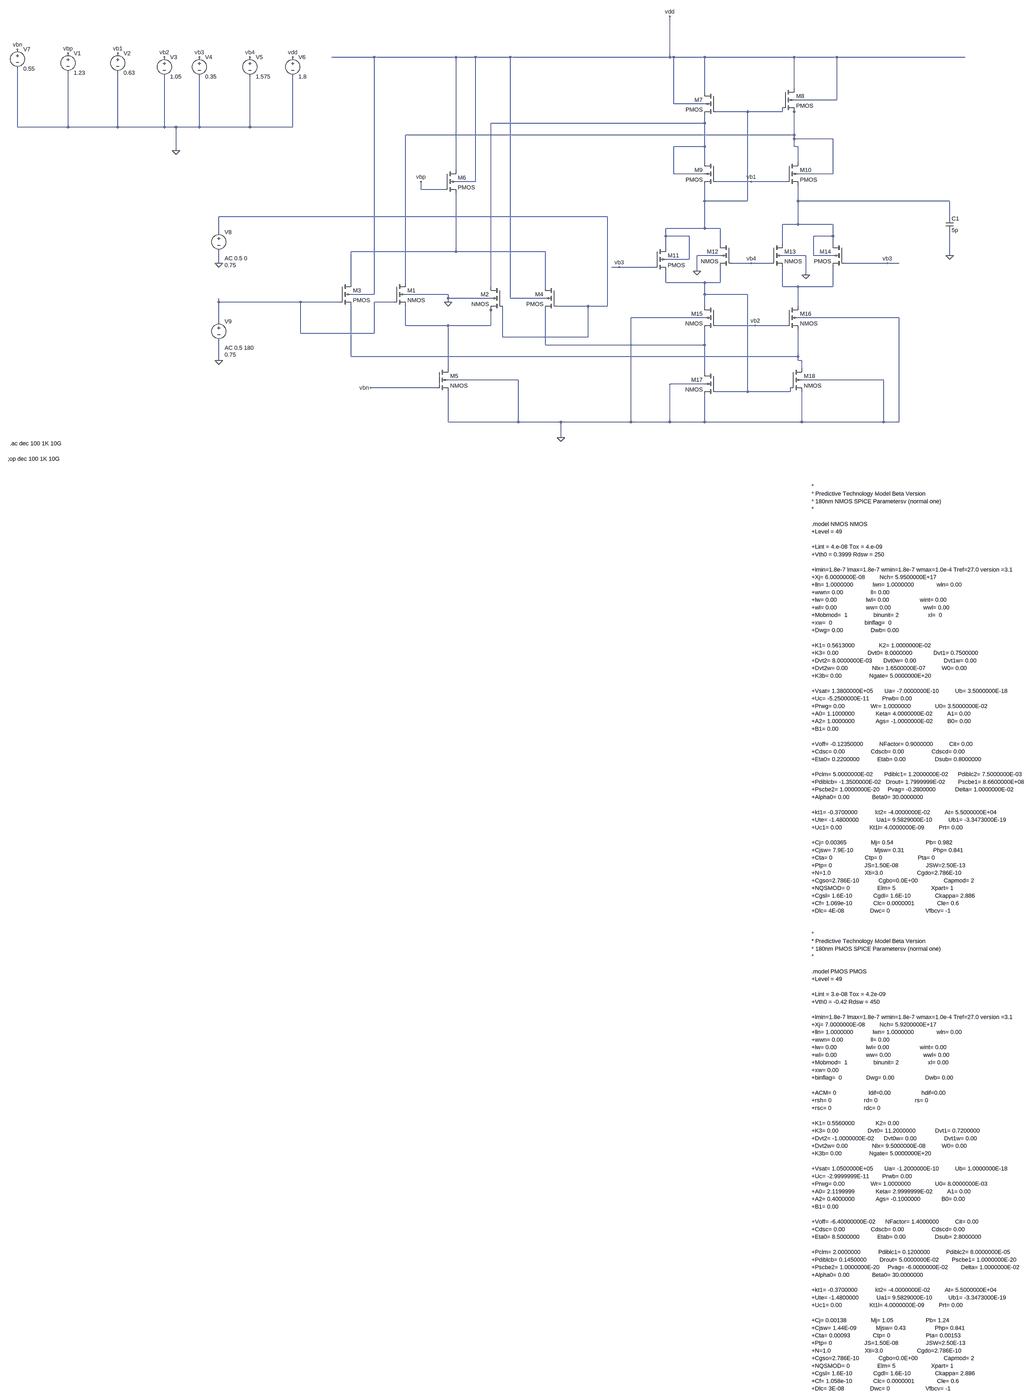
[diagram p0: schematic rail_to_rail_stage1.1_68db.asc, whole sheet]
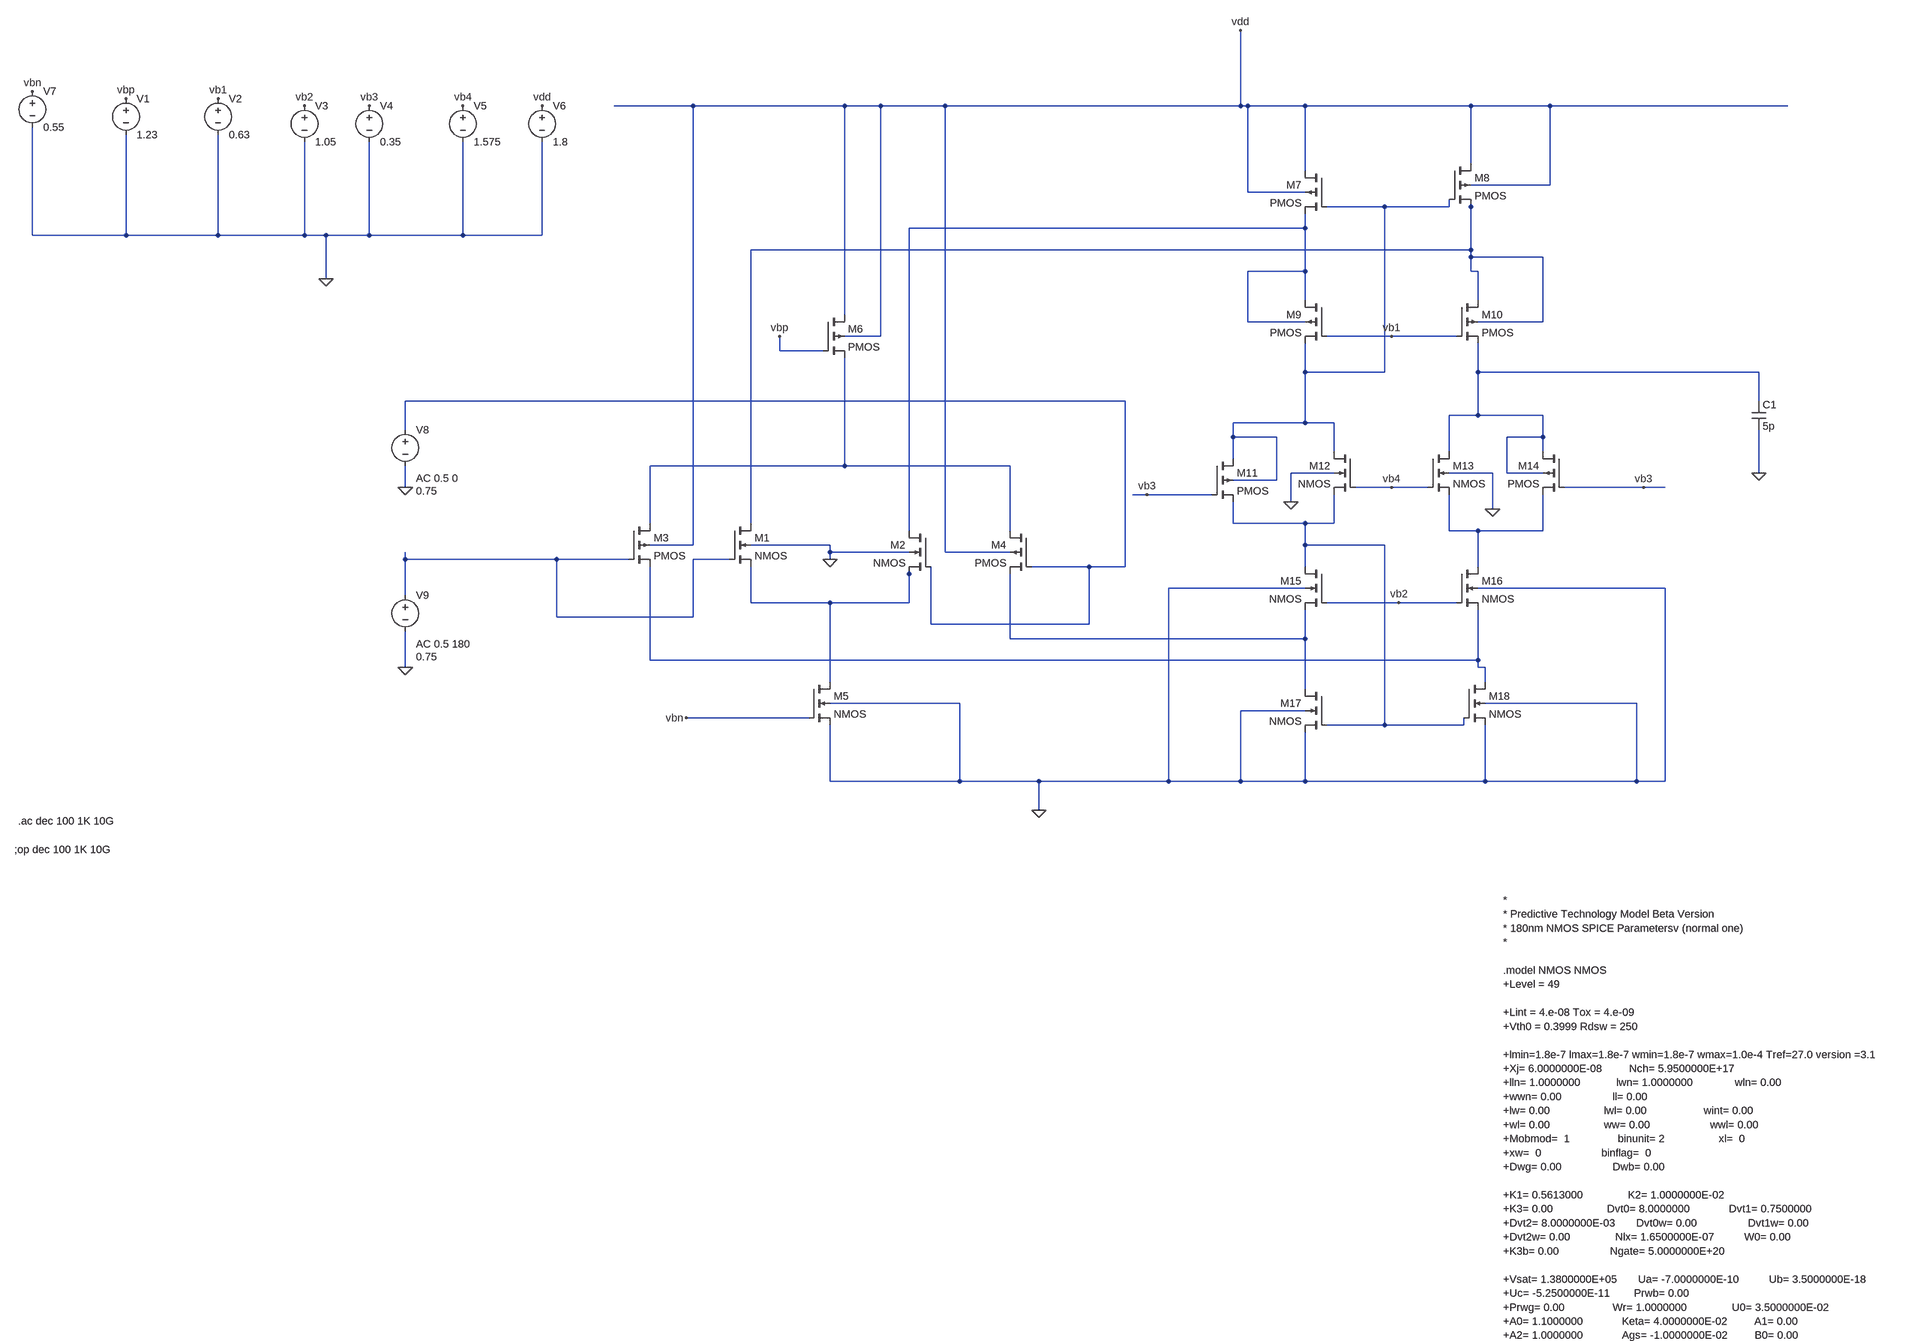
[diagram p1: schematic rail_to_rail_stage1.1_68db.asc, part, row 1 of 2, column 1 of 1]
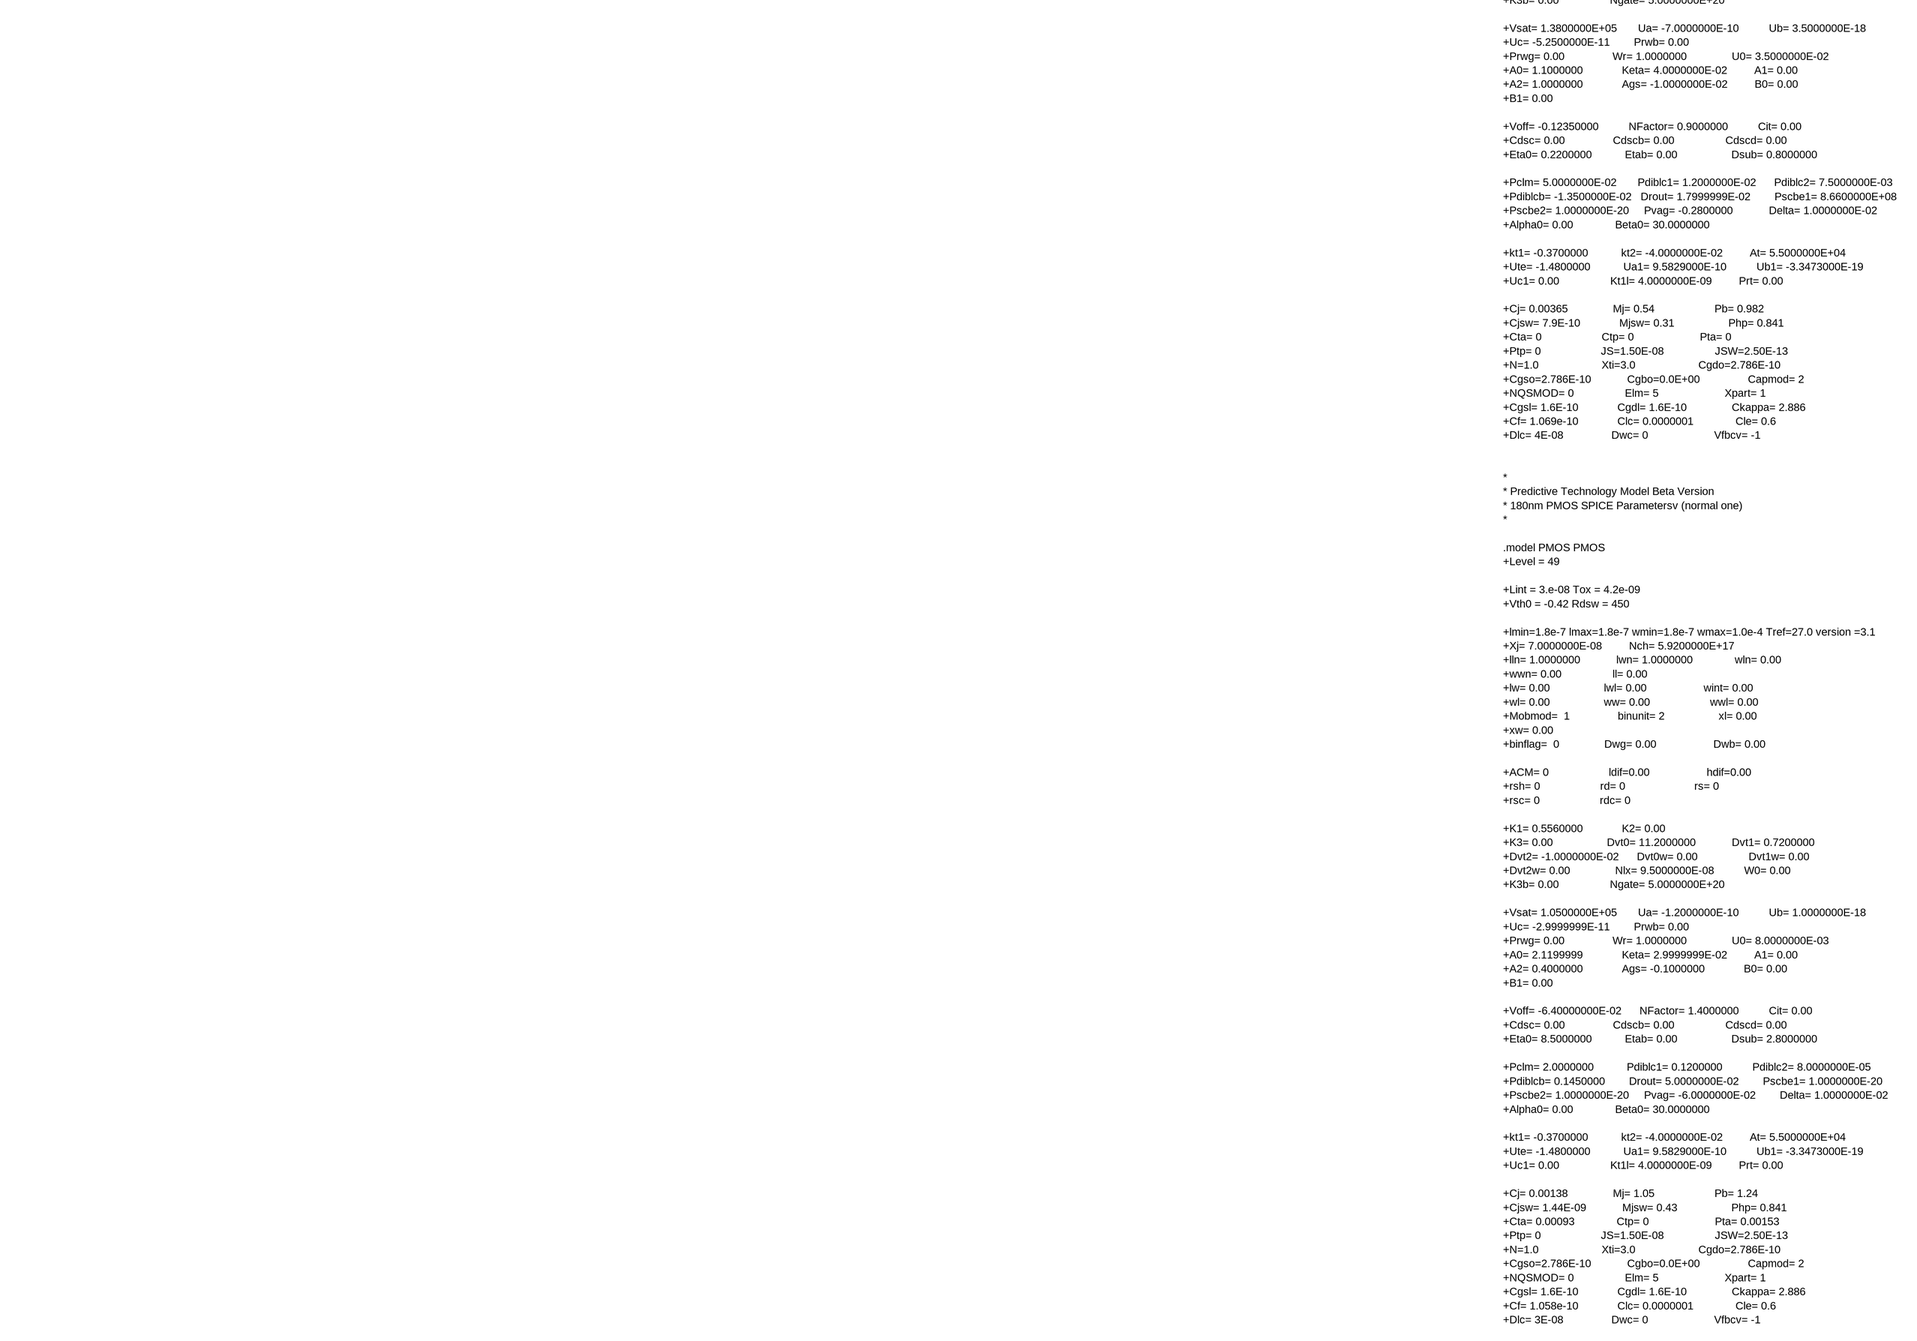
[diagram p2: schematic rail_to_rail_stage1.1_68db.asc, part, row 2 of 2, column 1 of 1]
rail_to_rail_stage1.1_68db.asc, the LTspice schematic file:
Version 4
SHEET 1 2760 4552
WIRE -144 -704 -320 -704
WIRE 192 -704 -144 -704
WIRE 272 -704 192 -704
WIRE 416 -704 272 -704
WIRE 1072 -704 1072 -912
WIRE 1072 -704 416 -704
WIRE 1088 -704 1072 -704
WIRE 1216 -704 1088 -704
WIRE 1584 -704 1216 -704
WIRE 1760 -704 1584 -704
WIRE 2288 -704 1760 -704
WIRE 1584 -576 1584 -704
WIRE 1216 -560 1216 -704
WIRE 1760 -528 1760 -704
WIRE 1760 -528 1584 -528
WIRE 1088 -512 1088 -704
WIRE 1216 -512 1088 -512
WIRE 1392 -480 1264 -480
WIRE 1536 -480 1536 -496
WIRE 1536 -480 1392 -480
WIRE 1584 -480 1584 -496
WIRE 1216 -432 1216 -464
WIRE 1216 -432 336 -432
WIRE -1696 -416 -1696 -656
WIRE -1488 -416 -1488 -640
WIRE -1488 -416 -1696 -416
WIRE -1280 -416 -1280 -640
WIRE -1280 -416 -1488 -416
WIRE -1088 -416 -1088 -624
WIRE -1088 -416 -1280 -416
WIRE -1040 -416 -1088 -416
WIRE -944 -416 -944 -624
WIRE -944 -416 -1040 -416
WIRE -736 -416 -736 -624
WIRE -736 -416 -944 -416
WIRE -560 -416 -560 -624
WIRE -560 -416 -736 -416
WIRE 1584 -384 1584 -480
WIRE 1584 -384 -16 -384
WIRE 1584 -368 1584 -384
WIRE 1744 -368 1584 -368
WIRE 1216 -336 1216 -432
WIRE 1216 -336 1088 -336
WIRE 1584 -336 1584 -368
WIRE 1600 -336 1584 -336
WIRE -1040 -320 -1040 -416
WIRE 1216 -272 1216 -336
WIRE 1600 -272 1600 -336
WIRE 192 -240 192 -704
WIRE 1088 -224 1088 -336
WIRE 1216 -224 1088 -224
WIRE 1744 -224 1744 -368
WIRE 1744 -224 1600 -224
WIRE 272 -192 272 -704
WIRE 272 -192 192 -192
WIRE 1408 -192 1264 -192
WIRE 1552 -192 1408 -192
WIRE 48 -160 48 -192
WIRE 144 -160 48 -160
WIRE 1216 -112 1216 -176
WIRE 1392 -112 1392 -480
WIRE 1392 -112 1216 -112
WIRE 1600 -112 1600 -176
WIRE 2224 -112 1600 -112
WIRE 816 -48 -864 -48
WIRE 2224 -48 2224 -112
WIRE 1600 -16 1600 -112
WIRE 1600 -16 1536 -16
WIRE 1744 -16 1600 -16
WIRE 1216 0 1216 -112
WIRE 1216 0 1056 0
WIRE 1280 0 1216 0
WIRE -864 16 -864 -48
WIRE 1056 32 1056 0
WIRE 1152 32 1056 32
WIRE 1744 32 1744 -16
WIRE 1744 32 1664 32
WIRE 1280 64 1280 0
WIRE 1536 64 1536 -16
WIRE 1744 64 1744 32
WIRE 1056 80 1056 32
WIRE 192 96 192 -144
WIRE 192 96 -240 96
WIRE 560 96 192 96
WIRE 1280 112 1184 112
WIRE 1632 112 1536 112
WIRE 1664 112 1664 32
WIRE 1744 112 1664 112
WIRE 2224 112 2224 16
WIRE 1152 128 1152 32
WIRE 1152 128 1056 128
WIRE -864 144 -864 96
WIRE 1408 144 1328 144
WIRE 1488 144 1408 144
WIRE 1968 144 1792 144
WIRE 2016 144 1968 144
WIRE 864 160 832 160
WIRE 1008 160 864 160
WIRE 1184 176 1184 112
WIRE 1632 192 1632 112
WIRE -240 224 -240 96
WIRE -16 224 -16 -384
WIRE 1056 224 1056 176
WIRE 1216 224 1056 224
WIRE 1280 224 1280 160
WIRE 1280 224 1216 224
WIRE 336 240 336 -432
WIRE 560 240 560 96
WIRE 1536 240 1536 160
WIRE 1600 240 1536 240
WIRE 1744 240 1744 160
WIRE 1744 240 1600 240
WIRE -144 272 -144 -704
WIRE -144 272 -240 272
WIRE 160 272 -16 272
WIRE 1216 272 1216 224
WIRE 1392 272 1216 272
WIRE 160 288 160 272
WIRE 336 288 160 288
WIRE 416 288 416 -704
WIRE 560 288 416 288
WIRE -864 304 -864 288
WIRE -528 304 -864 304
WIRE -288 304 -528 304
WIRE -64 304 -144 304
WIRE 160 304 160 288
WIRE 736 320 608 320
WIRE 816 320 816 -48
WIRE 816 320 736 320
WIRE 1216 320 1216 272
WIRE 1600 320 1600 240
WIRE 336 336 336 320
WIRE 1216 368 912 368
WIRE 2016 368 1600 368
WIRE -864 384 -864 304
WIRE -16 400 -16 320
WIRE 160 400 -16 400
WIRE 336 400 336 336
WIRE 336 400 160 400
WIRE 1424 400 1264 400
WIRE 1552 400 1424 400
WIRE -528 432 -528 304
WIRE -144 432 -144 304
WIRE -144 432 -528 432
WIRE 384 448 384 320
WIRE 736 448 736 320
WIRE 736 448 384 448
WIRE 560 480 560 336
WIRE 1216 480 1216 416
WIRE 1216 480 560 480
WIRE -240 528 -240 320
WIRE 1600 528 1600 416
WIRE 1600 528 -240 528
WIRE -864 544 -864 464
WIRE 1600 544 1600 528
WIRE 1616 544 1600 544
WIRE 160 576 160 400
WIRE 1616 576 1616 544
WIRE 1216 592 1216 480
WIRE 448 624 160 624
WIRE 1952 624 1616 624
WIRE 1216 640 1072 640
WIRE 112 656 -160 656
WIRE 1392 672 1392 272
WIRE 1392 672 1264 672
WIRE 1568 672 1568 656
WIRE 1568 672 1392 672
WIRE 160 912 160 672
WIRE 448 912 448 624
WIRE 448 912 160 912
WIRE 624 912 448 912
WIRE 912 912 912 368
WIRE 912 912 624 912
WIRE 1072 912 1072 640
WIRE 1072 912 912 912
WIRE 1216 912 1216 688
WIRE 1216 912 1072 912
WIRE 1616 912 1616 672
WIRE 1616 912 1216 912
WIRE 1952 912 1952 624
WIRE 1952 912 1616 912
WIRE 2016 912 2016 368
WIRE 2016 912 1952 912
WIRE 624 976 624 912
FLAG 160 304 0
FLAG 624 976 0
FLAG 1184 176 0
FLAG 1632 192 0
FLAG -1040 -320 0
FLAG -1280 -720 vb1
FLAG -1088 -704 vb2
FLAG -944 -704 vb3
FLAG -736 -704 vb4
FLAG -560 -704 vdd
FLAG 1424 400 vb2
FLAG 1408 144 vb4
FLAG 1408 -192 vb1
FLAG 1968 144 vb3
FLAG 864 160 vb3
FLAG 1072 -912 vdd
FLAG 48 -192 vbp
FLAG -160 656 vbn
FLAG -1696 -736 vbn
FLAG -1488 -720 vbp
FLAG -864 144 0
FLAG -864 544 0
FLAG 2224 112 0
SYMBOL nmos4 -64 224 R0
SYMATTR InstName M1
SYMATTR Value2 l=1u w=56u
SYMBOL nmos4 384 240 M0
SYMATTR InstName M2
SYMATTR Value2 l=1u w=56u
SYMBOL nmos4 112 576 R0
SYMATTR InstName M5
SYMATTR Value2 l=1u w=20u
SYMBOL nmos4 1568 576 R0
SYMATTR InstName M18
SYMATTR Value2 l=1u w=3u
SYMBOL nmos4 1552 320 R0
SYMATTR InstName M16
SYMATTR Value2 l=1u w=1.2u
SYMBOL nmos4 1264 320 M0
SYMATTR InstName M15
SYMATTR Value2 l=1u w=1.2u
SYMBOL nmos4 1264 592 M0
SYMATTR InstName M17
SYMATTR Value2 l=1u w=3u
SYMBOL nmos4 1328 64 M0
SYMATTR InstName M12
SYMATTR Value2 l=1u w=0.76u
SYMBOL nmos4 1488 64 R0
SYMATTR InstName M13
SYMATTR Value2 l=1u w=0.76u
SYMBOL pmos4 -288 224 R0
SYMATTR InstName M3
SYMATTR Value2 l=1u w=364u
SYMBOL pmos4 608 240 M0
SYMATTR InstName M4
SYMATTR Value2 l=1u w=364u
SYMBOL pmos4 144 -240 R0
SYMATTR InstName M6
SYMATTR Value2 l=1u w=110u
SYMBOL pmos4 1008 80 R0
SYMATTR InstName M11
SYMATTR Value2 l=1u w=3.2u
SYMBOL pmos4 1552 -272 R0
SYMATTR InstName M10
SYMATTR Value2 l=1u w=8u
SYMBOL pmos4 1536 -576 R0
SYMATTR InstName M8
SYMATTR Value2 l=1u w=13u
SYMBOL pmos4 1264 -560 M0
SYMATTR InstName M7
SYMATTR Value2 l=1u w=13u
SYMBOL pmos4 1264 -272 M0
SYMATTR InstName M9
SYMATTR Value2 l=1u w=8u
SYMBOL pmos4 1792 64 M0
SYMATTR InstName M14
SYMATTR Value2 l=1u w=3.2u
SYMBOL voltage -1280 -736 R0
WINDOW 123 0 0 Left 0
WINDOW 39 0 0 Left 0
SYMATTR InstName V2
SYMATTR Value 0.63
SYMBOL voltage -1088 -720 R0
WINDOW 123 0 0 Left 0
WINDOW 39 0 0 Left 0
SYMATTR InstName V3
SYMATTR Value 1.05
SYMBOL voltage -944 -720 R0
WINDOW 123 0 0 Left 0
WINDOW 39 0 0 Left 0
SYMATTR InstName V4
SYMATTR Value 0.35
SYMBOL voltage -736 -720 R0
WINDOW 123 0 0 Left 0
WINDOW 39 0 0 Left 0
SYMATTR InstName V5
SYMATTR Value 1.575
SYMBOL voltage -560 -720 R0
WINDOW 123 0 0 Left 0
WINDOW 39 0 0 Left 0
SYMATTR InstName V6
SYMATTR Value 1.8
SYMBOL voltage -1488 -736 R0
WINDOW 123 0 0 Left 0
WINDOW 39 0 0 Left 0
SYMATTR InstName V1
SYMATTR Value 1.23
SYMBOL voltage -1696 -752 R0
WINDOW 123 0 0 Left 0
WINDOW 39 0 0 Left 0
SYMATTR InstName V7
SYMATTR Value 0.55
SYMBOL voltage -864 0 R0
WINDOW 3 24 152 Left 2
WINDOW 123 24 124 Left 2
WINDOW 39 0 0 Left 0
SYMATTR Value 0.75
SYMATTR Value2 AC 0.5 0
SYMATTR InstName V8
SYMBOL voltage -864 368 R0
WINDOW 3 24 152 Left 2
WINDOW 123 24 124 Left 2
WINDOW 39 0 0 Left 0
SYMATTR Value 0.75
SYMATTR Value2 AC 0.5 180
SYMATTR InstName V9
SYMBOL cap 2208 -48 R0
SYMATTR InstName C1
SYMATTR Value 5p
TEXT -1728 1000 Left 2 !.ac dec 100 1K 10G
TEXT 1656 1176 Left 2 !*\n* Predictive Technology Model Beta Version\n* 180nm NMOS SPICE Parametersv (normal one)\n*\n \n.model NMOS NMOS\n+Level = 49\n \n+Lint = 4.e-08 Tox = 4.e-09 \n+Vth0 = 0.3999 Rdsw = 250 \n \n+lmin=1.8e-7 lmax=1.8e-7 wmin=1.8e-7 wmax=1.0e-4 Tref=27.0 version =3.1\n+Xj= 6.0000000E-08         Nch= 5.9500000E+17 \n+lln= 1.0000000            lwn= 1.0000000              wln= 0.00\n+wwn= 0.00                 ll= 0.00\n+lw= 0.00                  lwl= 0.00                   wint= 0.00\n+wl= 0.00                  ww= 0.00                    wwl= 0.00\n+Mobmod=  1                binunit= 2                  xl=  0\n+xw=  0                    binflag=  0\n+Dwg= 0.00                 Dwb= 0.00 \n \n+K1= 0.5613000               K2= 1.0000000E-02 \n+K3= 0.00                  Dvt0= 8.0000000             Dvt1= 0.7500000 \n+Dvt2= 8.0000000E-03       Dvt0w= 0.00                 Dvt1w= 0.00 \n+Dvt2w= 0.00               Nlx= 1.6500000E-07          W0= 0.00 \n+K3b= 0.00                 Ngate= 5.0000000E+20 \n \n+Vsat= 1.3800000E+05       Ua= -7.0000000E-10          Ub= 3.5000000E-18 \n+Uc= -5.2500000E-11        Prwb= 0.00 \n+Prwg= 0.00                Wr= 1.0000000               U0= 3.5000000E-02 \n+A0= 1.1000000             Keta= 4.0000000E-02         A1= 0.00 \n+A2= 1.0000000             Ags= -1.0000000E-02         B0= 0.00 \n+B1= 0.00 \n \n+Voff= -0.12350000          NFactor= 0.9000000          Cit= 0.00 \n+Cdsc= 0.00                Cdscb= 0.00                 Cdscd= 0.00 \n+Eta0= 0.2200000           Etab= 0.00                  Dsub= 0.8000000 \n \n+Pclm= 5.0000000E-02       Pdiblc1= 1.2000000E-02      Pdiblc2= 7.5000000E-03 \n+Pdiblcb= -1.3500000E-02   Drout= 1.7999999E-02        Pscbe1= 8.6600000E+08 \n+Pscbe2= 1.0000000E-20     Pvag= -0.2800000            Delta= 1.0000000E-02 \n+Alpha0= 0.00              Beta0= 30.0000000 \n \n+kt1= -0.3700000           kt2= -4.0000000E-02         At= 5.5000000E+04 \n+Ute= -1.4800000           Ua1= 9.5829000E-10          Ub1= -3.3473000E-19 \n+Uc1= 0.00                 Kt1l= 4.0000000E-09         Prt= 0.00 \n \n+Cj= 0.00365               Mj= 0.54                    Pb= 0.982\n+Cjsw= 7.9E-10             Mjsw= 0.31                  Php= 0.841\n+Cta= 0                    Ctp= 0                      Pta= 0\n+Ptp= 0                    JS=1.50E-08                 JSW=2.50E-13\n+N=1.0                     Xti=3.0                     Cgdo=2.786E-10\n+Cgso=2.786E-10            Cgbo=0.0E+00                Capmod= 2\n+NQSMOD= 0                 Elm= 5                      Xpart= 1\n+Cgsl= 1.6E-10             Cgdl= 1.6E-10               Ckappa= 2.886\n+Cf= 1.069e-10             Clc= 0.0000001              Cle= 0.6\n+Dlc= 4E-08                Dwc= 0                      Vfbcv= -1\n \n \n*\n* Predictive Technology Model Beta Version\n* 180nm PMOS SPICE Parametersv (normal one)\n*\n \n.model PMOS PMOS\n+Level = 49\n \n+Lint = 3.e-08 Tox = 4.2e-09 \n+Vth0 = -0.42 Rdsw = 450 \n \n+lmin=1.8e-7 lmax=1.8e-7 wmin=1.8e-7 wmax=1.0e-4 Tref=27.0 version =3.1\n+Xj= 7.0000000E-08         Nch= 5.9200000E+17 \n+lln= 1.0000000            lwn= 1.0000000              wln= 0.00\n+wwn= 0.00                 ll= 0.00\n+lw= 0.00                  lwl= 0.00                   wint= 0.00\n+wl= 0.00                  ww= 0.00                    wwl= 0.00\n+Mobmod=  1                binunit= 2                  xl= 0.00\n+xw= 0.00                  \n+binflag=  0               Dwg= 0.00                   Dwb= 0.00 \n \n+ACM= 0                    ldif=0.00                   hdif=0.00\n+rsh= 0                    rd= 0                       rs= 0\n+rsc= 0                    rdc= 0\n \n+K1= 0.5560000             K2= 0.00 \n+K3= 0.00                  Dvt0= 11.2000000            Dvt1= 0.7200000 \n+Dvt2= -1.0000000E-02      Dvt0w= 0.00                 Dvt1w= 0.00 \n+Dvt2w= 0.00               Nlx= 9.5000000E-08          W0= 0.00 \n+K3b= 0.00                 Ngate= 5.0000000E+20 \n \n+Vsat= 1.0500000E+05       Ua= -1.2000000E-10          Ub= 1.0000000E-18 \n+Uc= -2.9999999E-11        Prwb= 0.00 \n+Prwg= 0.00                Wr= 1.0000000               U0= 8.0000000E-03 \n+A0= 2.1199999             Keta= 2.9999999E-02         A1= 0.00 \n+A2= 0.4000000             Ags= -0.1000000             B0= 0.00 \n+B1= 0.00 \n \n+Voff= -6.40000000E-02      NFactor= 1.4000000          Cit= 0.00 \n+Cdsc= 0.00                Cdscb= 0.00                 Cdscd= 0.00 \n+Eta0= 8.5000000           Etab= 0.00                  Dsub= 2.8000000 \n \n+Pclm= 2.0000000           Pdiblc1= 0.1200000          Pdiblc2= 8.0000000E-05 \n+Pdiblcb= 0.1450000        Drout= 5.0000000E-02        Pscbe1= 1.0000000E-20 \n+Pscbe2= 1.0000000E-20     Pvag= -6.0000000E-02        Delta= 1.0000000E-02 \n+Alpha0= 0.00              Beta0= 30.0000000 \n \n+kt1= -0.3700000           kt2= -4.0000000E-02         At= 5.5000000E+04 \n+Ute= -1.4800000           Ua1= 9.5829000E-10          Ub1= -3.3473000E-19 \n+Uc1= 0.00                 Kt1l= 4.0000000E-09         Prt= 0.00 \n \n+Cj= 0.00138               Mj= 1.05                    Pb= 1.24\n+Cjsw= 1.44E-09            Mjsw= 0.43                  Php= 0.841\n+Cta= 0.00093              Ctp= 0                      Pta= 0.00153\n+Ptp= 0                    JS=1.50E-08                 JSW=2.50E-13\n+N=1.0                     Xti=3.0                     Cgdo=2.786E-10\n+Cgso=2.786E-10            Cgbo=0.0E+00                Capmod= 2\n+NQSMOD= 0                 Elm= 5                      Xpart= 1\n+Cgsl= 1.6E-10             Cgdl= 1.6E-10               Ckappa= 2.886\n+Cf= 1.058e-10             Clc= 0.0000001              Cle= 0.6\n+Dlc= 3E-08                Dwc= 0                      Vfbcv= -1
TEXT -1736 1064 Left 2 !;op dec 100 1K 10G

The netlist it stands for:
* rail_to_rail_stage1.1_68db.asc
M1 N002 N009 N010 0 NMOS l=1u w=56u
M2 N003 N005 N010 0 NMOS l=1u w=56u
M5 N010 vbn 0 0 NMOS l=1u w=20u
M18 N012 N007 0 0 NMOS l=1u w=3u
M16 N008 vb2 N012 0 NMOS l=1u w=1.2u
M15 N007 vb2 N011 0 NMOS l=1u w=1.2u
M17 N011 N007 0 0 NMOS l=1u w=3u
M12 N001 vb4 N007 0 NMOS l=1u w=0.76u
M13 N004 vb4 N008 0 NMOS l=1u w=0.76u
M3 N006 N009 N012 vdd PMOS l=1u w=364u
M4 N006 N005 N011 vdd PMOS l=1u w=364u
M6 vdd vbp N006 vdd PMOS l=1u w=110u
M11 N001 vb3 N007 N001 PMOS l=1u w=3.2u
M10 N002 vb1 N004 N002 PMOS l=1u w=8u
M8 vdd N001 N002 vdd PMOS l=1u w=13u
M7 vdd N001 N003 vdd PMOS l=1u w=13u
M9 N003 vb1 N001 N003 PMOS l=1u w=8u
M14 N004 vb3 N008 N004 PMOS l=1u w=3.2u
V2 vb1 0 0.63
V3 vb2 0 1.05
V4 vb3 0 0.35
V5 vb4 0 1.575
V6 vdd 0 1.8
V1 vbp 0 1.23
V7 vbn 0 0.55
V8 N005 0 0.75 AC 0.5 0
V9 N009 0 0.75 AC 0.5 180
C1 N004 0 5p
.model NMOS NMOS
.model PMOS PMOS
.lib standard.mos
.ac dec 100 1K 10G
*
* Predictive Technology Model Beta Version
* 180nm NMOS SPICE Parametersv (normal one)
*
.model NMOS NMOS
+Level = 49
+Lint = 4.e-08 Tox = 4.e-09
+Vth0 = 0.3999 Rdsw = 250
+lmin=1.8e-7 lmax=1.8e-7 wmin=1.8e-7 wmax=1.0e-4 Tref=27.0 version =3.1
+Xj= 6.0000000E-08         Nch= 5.9500000E+17
+lln= 1.0000000            lwn= 1.0000000              wln= 0.00
+wwn= 0.00                 ll= 0.00
+lw= 0.00                  lwl= 0.00                   wint= 0.00
+wl= 0.00                  ww= 0.00                    wwl= 0.00
+Mobmod=  1                binunit= 2                  xl=  0
+xw=  0                    binflag=  0
+Dwg= 0.00                 Dwb= 0.00
+K1= 0.5613000               K2= 1.0000000E-02
+K3= 0.00                  Dvt0= 8.0000000             Dvt1= 0.7500000
+Dvt2= 8.0000000E-03       Dvt0w= 0.00                 Dvt1w= 0.00
+Dvt2w= 0.00               Nlx= 1.6500000E-07          W0= 0.00
+K3b= 0.00                 Ngate= 5.0000000E+20
+Vsat= 1.3800000E+05       Ua= -7.0000000E-10          Ub= 3.5000000E-18
+Uc= -5.2500000E-11        Prwb= 0.00
+Prwg= 0.00                Wr= 1.0000000               U0= 3.5000000E-02
+A0= 1.1000000             Keta= 4.0000000E-02         A1= 0.00
+A2= 1.0000000             Ags= -1.0000000E-02         B0= 0.00
+B1= 0.00
+Voff= -0.12350000          NFactor= 0.9000000          Cit= 0.00
+Cdsc= 0.00                Cdscb= 0.00                 Cdscd= 0.00
+Eta0= 0.2200000           Etab= 0.00                  Dsub= 0.8000000
+Pclm= 5.0000000E-02       Pdiblc1= 1.2000000E-02      Pdiblc2= 7.5000000E-03
+Pdiblcb= -1.3500000E-02   Drout= 1.7999999E-02        Pscbe1= 8.6600000E+08
+Pscbe2= 1.0000000E-20     Pvag= -0.2800000            Delta= 1.0000000E-02
+Alpha0= 0.00              Beta0= 30.0000000
+kt1= -0.3700000           kt2= -4.0000000E-02         At= 5.5000000E+04
+Ute= -1.4800000           Ua1= 9.5829000E-10          Ub1= -3.3473000E-19
+Uc1= 0.00                 Kt1l= 4.0000000E-09         Prt= 0.00
+Cj= 0.00365               Mj= 0.54                    Pb= 0.982
+Cjsw= 7.9E-10             Mjsw= 0.31                  Php= 0.841
+Cta= 0                    Ctp= 0                      Pta= 0
+Ptp= 0                    JS=1.50E-08                 JSW=2.50E-13
+N=1.0                     Xti=3.0                     Cgdo=2.786E-10
+Cgso=2.786E-10            Cgbo=0.0E+00                Capmod= 2
+NQSMOD= 0                 Elm= 5                      Xpart= 1
+Cgsl= 1.6E-10             Cgdl= 1.6E-10               Ckappa= 2.886
+Cf= 1.069e-10             Clc= 0.0000001              Cle= 0.6
+Dlc= 4E-08                Dwc= 0                      Vfbcv= -1
*
* Predictive Technology Model Beta Version
* 180nm PMOS SPICE Parametersv (normal one)
*
.model PMOS PMOS
+Level = 49
+Lint = 3.e-08 Tox = 4.2e-09
+Vth0 = -0.42 Rdsw = 450
+lmin=1.8e-7 lmax=1.8e-7 wmin=1.8e-7 wmax=1.0e-4 Tref=27.0 version =3.1
+Xj= 7.0000000E-08         Nch= 5.9200000E+17
+lln= 1.0000000            lwn= 1.0000000              wln= 0.00
+wwn= 0.00                 ll= 0.00
+lw= 0.00                  lwl= 0.00                   wint= 0.00
+wl= 0.00                  ww= 0.00                    wwl= 0.00
+Mobmod=  1                binunit= 2                  xl= 0.00
+xw= 0.00
+binflag=  0               Dwg= 0.00                   Dwb= 0.00
+ACM= 0                    ldif=0.00                   hdif=0.00
+rsh= 0                    rd= 0                       rs= 0
+rsc= 0                    rdc= 0
+K1= 0.5560000             K2= 0.00
+K3= 0.00                  Dvt0= 11.2000000            Dvt1= 0.7200000
+Dvt2= -1.0000000E-02      Dvt0w= 0.00                 Dvt1w= 0.00
+Dvt2w= 0.00               Nlx= 9.5000000E-08          W0= 0.00
+K3b= 0.00                 Ngate= 5.0000000E+20
+Vsat= 1.0500000E+05       Ua= -1.2000000E-10          Ub= 1.0000000E-18
+Uc= -2.9999999E-11        Prwb= 0.00
+Prwg= 0.00                Wr= 1.0000000               U0= 8.0000000E-03
+A0= 2.1199999             Keta= 2.9999999E-02         A1= 0.00
+A2= 0.4000000             Ags= -0.1000000             B0= 0.00
+B1= 0.00
+Voff= -6.40000000E-02      NFactor= 1.4000000          Cit= 0.00
+Cdsc= 0.00                Cdscb= 0.00                 Cdscd= 0.00
+Eta0= 8.5000000           Etab= 0.00                  Dsub= 2.8000000
+Pclm= 2.0000000           Pdiblc1= 0.1200000          Pdiblc2= 8.0000000E-05
+Pdiblcb= 0.1450000        Drout= 5.0000000E-02        Pscbe1= 1.0000000E-20
+Pscbe2= 1.0000000E-20     Pvag= -6.0000000E-02        Delta= 1.0000000E-02
+Alpha0= 0.00              Beta0= 30.0000000
+kt1= -0.3700000           kt2= -4.0000000E-02         At= 5.5000000E+04
+Ute= -1.4800000           Ua1= 9.5829000E-10          Ub1= -3.3473000E-19
+Uc1= 0.00                 Kt1l= 4.0000000E-09         Prt= 0.00
+Cj= 0.00138               Mj= 1.05                    Pb= 1.24
+Cjsw= 1.44E-09            Mjsw= 0.43                  Php= 0.841
+Cta= 0.00093              Ctp= 0                      Pta= 0.00153
+Ptp= 0                    JS=1.50E-08                 JSW=2.50E-13
+N=1.0                     Xti=3.0                     Cgdo=2.786E-10
+Cgso=2.786E-10            Cgbo=0.0E+00                Capmod= 2
+NQSMOD= 0                 Elm= 5                      Xpart= 1
+Cgsl= 1.6E-10             Cgdl= 1.6E-10               Ckappa= 2.886
+Cf= 1.058e-10             Clc= 0.0000001              Cle= 0.6
+Dlc= 3E-08                Dwc= 0                      Vfbcv= -1
;op dec 100 1K 10G
.backanno
.end